# EAGLE design fc64x8 (EAGLE 6.3)
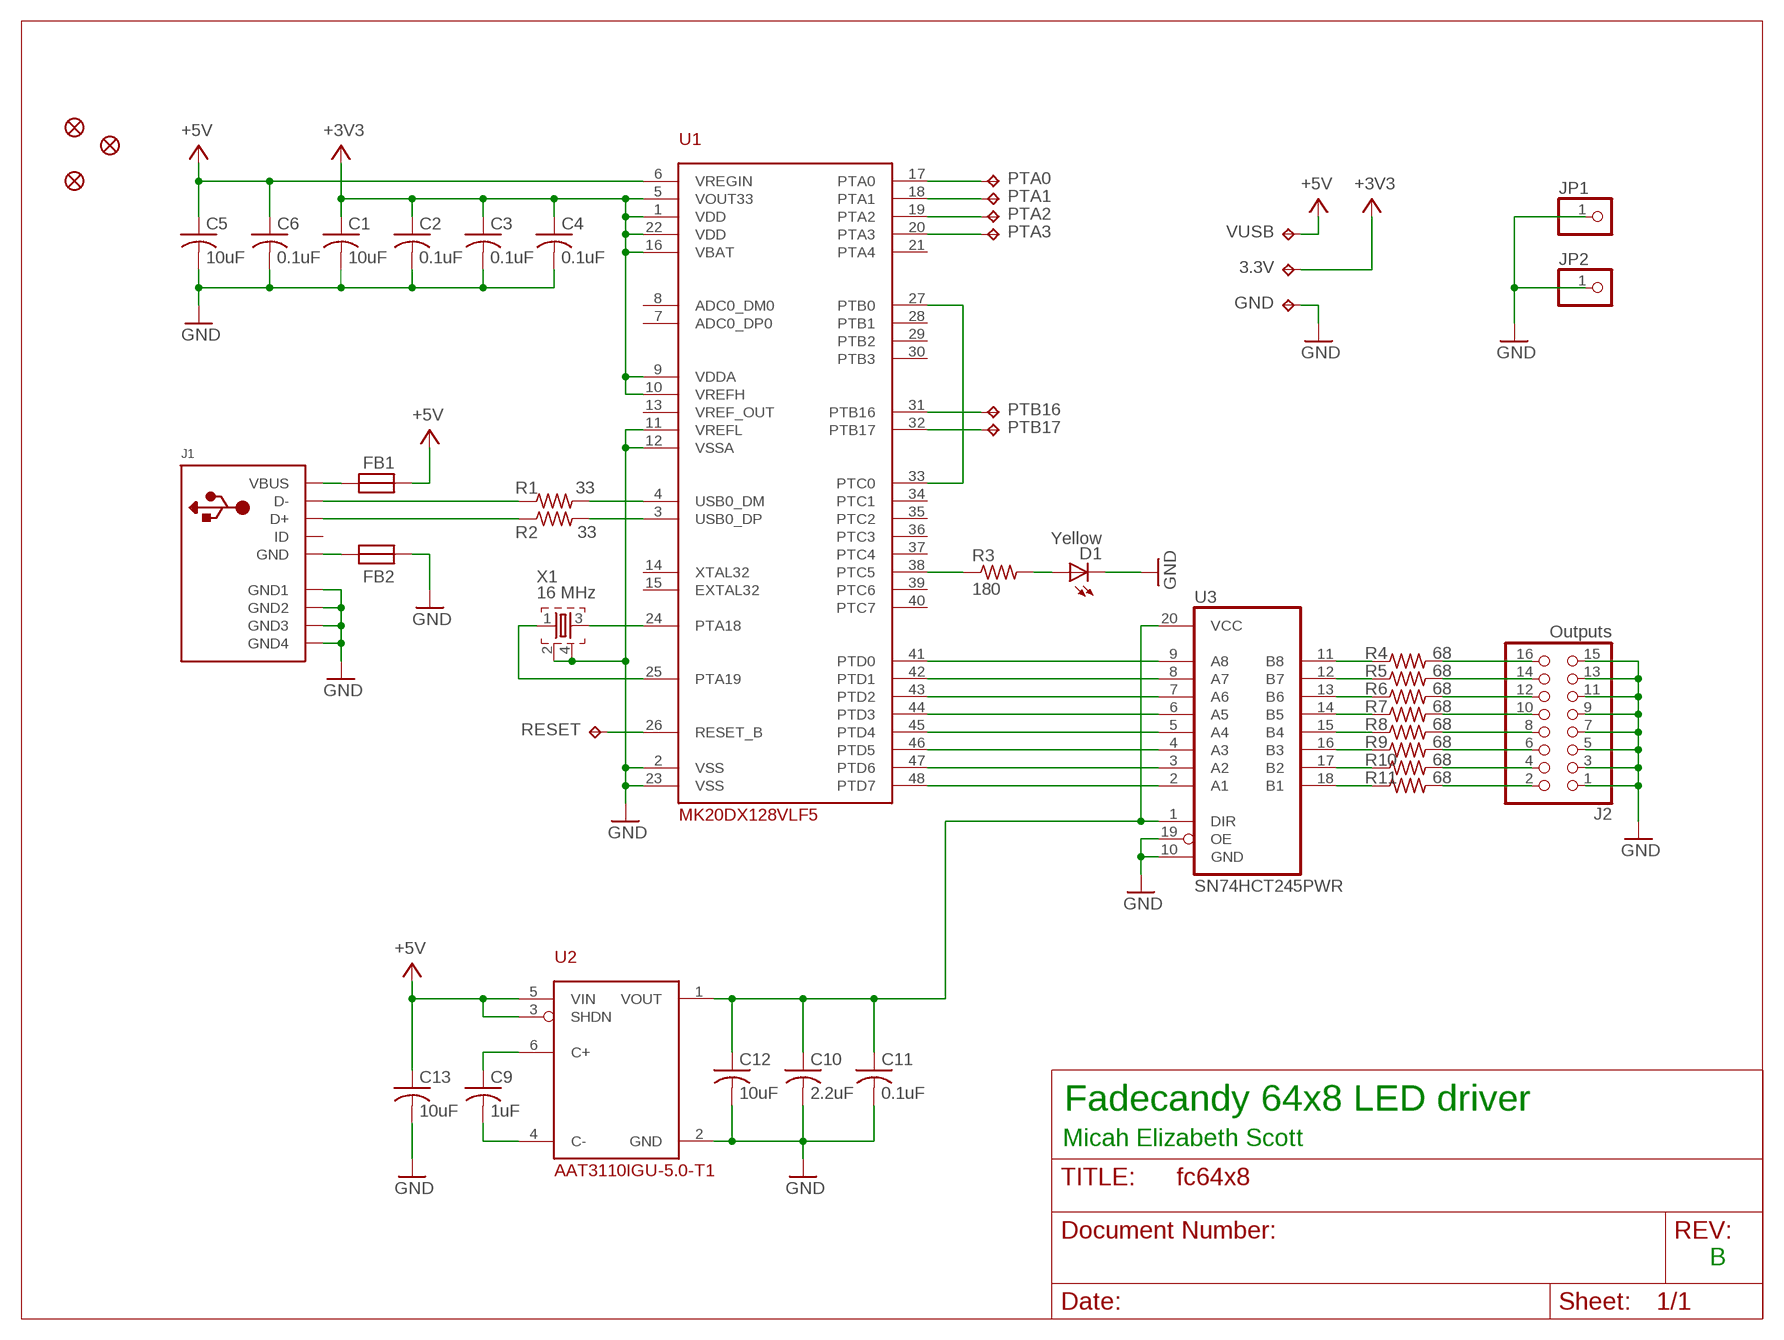
[diagram p0: schematic, sheet 1]

## Parts
3.3V  TPTP18SQ  [TP18SQ]
C1  10uF  C-US0805/NO-OUTLINE  [0805]
C2  0.1uF  C-US0805/NO-OUTLINE  [0805]
C3  0.1uF  C-US0805/NO-OUTLINE  [0805]
C4  0.1uF  C-US0805/NO-OUTLINE  [0805]
C5  10uF  C-US0805/NO-OUTLINE  [0805]
C6  0.1uF  C-US0805/NO-OUTLINE  [0805]
C9  1uF  C-US0805/NO-OUTLINE  [0805]
C10  2.2uF  C-US0805/NO-OUTLINE  [0805]
C11  0.1uF  C-US0805/NO-OUTLINE  [0805]
C12  10uF  C-US0805/NO-OUTLINE  [0805]
C13  10uF  C-US0805/NO-OUTLINE  [0805]
D1  Yellow  LEDCHIP-LED0805  [CHIP-LED0805]
FB1  FB0805/NO-OUTLINE  [0805]
FB2  FB0805/NO-OUTLINE  [0805]
FID1  FIDUCIAL""  [FIDUCIAL_1MM]
FID2  FIDUCIAL""  [FIDUCIAL_1MM]
FID3  FIDUCIAL""  [FIDUCIAL_1MM]
GND  TPTP18SQ  [TP18SQ]
J1  USBMINIB  [USB-MINIB]
J2  Outputs  PINHD-2X8  [2X08]
JP1  PINHD-1X1  [1X01]
JP2  PINHD-1X1  [1X01]
PTA0  TPTP18SQ  [TP18SQ]
PTA1  TPTP18SQ  [TP18SQ]
PTA2  TPTP18SQ  [TP18SQ]
PTA3  TPTP18SQ  [TP18SQ]
PTB16  TPTP18SQ  [TP18SQ]
PTB17  TPTP18SQ  [TP18SQ]
R1  33  R-US_0805/NO-OUTLINE  [0805]
R2  33  R-US_0805/NO-OUTLINE  [0805]
R3  180  R-US_0805/NO-OUTLINE  [0805]
R4  68  R-US_0805/NO-OUTLINE  [0805]
R5  68  R-US_0805/NO-OUTLINE  [0805]
R6  68  R-US_0805/NO-OUTLINE  [0805]
R7  68  R-US_0805/NO-OUTLINE  [0805]
R8  68  R-US_0805/NO-OUTLINE  [0805]
R9  68  R-US_0805/NO-OUTLINE  [0805]
R10  68  R-US_0805/NO-OUTLINE  [0805]
R11  68  R-US_0805/NO-OUTLINE  [0805]
RESET  TPTP18SQ  [TP18SQ]
U1  MK20DX128VLF5  [LQFP48]
U2  AAT3110IGU-5.0-T1  AAT3110  [SOT23-6L]
U3  SN74HCT245PWR  74245PW  [TSSOP20]
VUSB  TPTP18SQ  [TP18SQ]
X1  16 MHz  TSX-32250  [TSX-3225]

## Nets
+3V3: 3.3V.TP C1.1 C2.1 C3.1 C4.1 U1.1(VDD) U1.5(VOUT33) U1.9(VDDA) U1.10(VREFH) U1.16(VBAT) U1.22(VDD)
+5V: C5.1 C6.1 C13.1 FB1.2 U1.6(VREGIN) U2.3(SHDN) U2.5(VIN) VUSB.TP
GND: C1.2 C2.2 C3.2 C4.2 C5.2 C6.2 C10.2 C11.2 C12.2 C13.2 D1.C FB2.2 GND.TP J1.GND1 J1.GND2 J1.GND3 J1.GND4 J2.1 J2.3 J2.5 J2.7 J2.9 J2.11 J2.13 J2.15 JP1.1 JP2.1 U1.2(VSS) U1.11(VREFL) U1.12(VSSA) U1.23(VSS) U2.2(GND) U3.10(GND) U3.19(OE) X1.2 X1.4
N$1: R3.1 U1.38(PTC5)
N$2: U1.24(PTA18) X1.3
N$3: D1.A R3.2
N$4: U1.25(PTA19) X1.1
N$5: FB1.1 J1.VBUS
N$6: U1.27(PTB0) U1.33(PTC0)
N$7: FB2.1 J1.GND
N$8: U1.41(PTD0) U3.9(A8)
N$9: J1.D- R1.1
N$10: J1.D+ R2.1
N$11: R1.2 U1.4(USB0_DM)
N$12: R2.2 U1.3(USB0_DP)
N$13: U1.42(PTD1) U3.8(A7)
N$14: U1.43(PTD2) U3.7(A6)
N$15: U1.44(PTD3) U3.6(A5)
N$16: U1.45(PTD4) U3.5(A4)
N$17: U1.46(PTD5) U3.4(A3)
N$18: U1.47(PTD6) U3.3(A2)
N$19: U1.48(PTD7) U3.2(A1)
N$20: R4.1 U3.11(B8)
N$21: C9.1 U2.6(C+)
N$22: C9.2 U2.4(C-)
N$23: R5.1 U3.12(B7)
N$24: R6.1 U3.13(B6)
N$25: R7.1 U3.14(B5)
N$26: R8.1 U3.15(B4)
N$27: C10.1 C11.1 C12.1 U2.1(VOUT) U3.1(DIR) U3.20(VCC)
N$28: R9.1 U3.16(B3)
N$29: R10.1 U3.17(B2)
N$30: R11.1 U3.18(B1)
N$31: J2.16 R4.2
N$32: J2.14 R5.2
N$33: J2.12 R6.2
N$34: J2.10 R7.2
N$35: J2.8 R8.2
N$36: J2.6 R9.2
N$37: J2.4 R10.2
N$38: J2.2 R11.2
N$39: RESET.TP U1.26(RESET_B)
N$40: PTA0.TP U1.17(PTA0)
N$41: PTA1.TP U1.18(PTA1)
N$42: PTA2.TP U1.19(PTA2)
N$43: PTA3.TP U1.20(PTA3)
N$45: PTB16.TP U1.31(PTB16)
N$46: PTB17.TP U1.32(PTB17)
Unconnected: J1.ID U1.7(ADC0_DP0) U1.8(ADC0_DM0) U1.13(VREF_OUT) U1.14(XTAL32) U1.15(EXTAL32) U1.21(PTA4) U1.28(PTB1) U1.29(PTB2) U1.30(PTB3) U1.34(PTC1) U1.35(PTC2) U1.36(PTC3) U1.37(PTC4) U1.39(PTC6) U1.40(PTC7)

## Notes on the sheet
- Fadecandy 64x8 LED driver
- Micah Elizabeth Scott
- B

## Library data of the parts
3.3V GND PTA0 PTA1-PTA3 PTB16 PTB17 RESET VUSB = testpad:TP: Test pad
C1-C6 C9-C13 = scanlime:C-US: CAPACITOR, American symbol
D1 = adafruit:LED: LED OSRAM: - CHIPLED LG R971, LG N971, LY N971, LG Q971, LY Q971, LO R971, LY R971 LH N974, LH R974 LS Q976, LO Q976, LY Q976 LO Q996 - Hyper CHIPLED LW Q18S LB Q993, LB Q99A, LB R99A - SideLED LS A670, LO A670, LY A670, LG A670, LP A670 LB A673, LV A673, LT A673, LW A673 LH A674 LY A675 LS A676, LA A676, LO A676, LY A676, LW A676 LS A679, LY A679, LG A679 - Hyper Micro SIDELED® LS Y876, LA Y876, LO Y876, LY Y876 LT Y87S - SmartLED LW L88C, LW L88S LB L89C, LB L89S, LG L890 LS L89K, LO L89K, LY L89K LS L896, LA L896, LO L896, LY L896 - TOPLED LS T670, LO T670, LY T670, LG T670, LP T670 LSG T670, LSP T670, LSY T670, LOP T670, LYG T670 LG T671, LOG T671, LSG T671 LB T673, LV T673, LT T673, LW T673 LH T674 LS T676, LA T676, LO T676, LY T676, LB T676, LH T676, LSB T676, LW T676 LB T67C, LV T67C, LT T67C, LS T67K, LO T67K, LY T67K, LW E67C LS E67B, LA E67B, LO E67B, LY E67B, LB E67C, LV E67C, LT E67C LW T67C LS T679, LY T679, LG T679 LS T770, LO T770, LY T770, LG T770, LP T770 LB T773, LV T773, LT T773, LW T773 LH T774 LS E675, LA E675, LY E675, LS T675 LS T776, LA T776, LO T776, LY T776, LB T776 LHGB T686 LT T68C, LB T68C - Hyper Mini TOPLED® LB M676 - Mini TOPLED Santana® LG M470 LS M47K, LO M47K, LY M47K Source: http://www.osram.convergy.de/
FB1 FB2 = scanlime:FB
FID1-FID3 = microbuilder:FIDUCIAL: Fiducial Alignment Points Various fiducial points for machine vision alignment.; BOM: EXCLUDE
J1 = scanlime:USB: USB Connectors USBMINIB - Surface Mount Female Mini-B USB Connector 4UConnector: 06564 By microbuilder.eu Thru-hole RA Female Mini-B USB Connector 4UConnector: 18732 By ladyada.net
J2 = pinhead:PINHD-2X8: PIN HEADER
JP1 JP2 = pinhead:PINHD-1X1: PIN HEADER
R1-R11 = scanlime:R-US_: RESISTOR, American symbol
U1 = scanlime:MK20DX128VLF5: ARM Cortex-M4 microcontroller with USB. Freescale K20 series 50 MHz 16 K RAM 128 K Flash Lower pincount equivalent to Teensy 3.0 2013 Price: $2.66 qty 100 Digi-Key: MK20DX128VLF50-ND <http://www.digikey.com/product-detail/en/MK20DX128VLF5/MK20DX128VLF50-ND/3507511>
U2 = scanlime:AAT3110: Switched capacitor boost converter
U3 = scanlime:74*245: Octal BUS TRANSCEIVER, 3-state
X1 = scanlime:TSX-3225: MHz RANGE CRYSTAL UNIT Source: Epson Toyocom

## Board
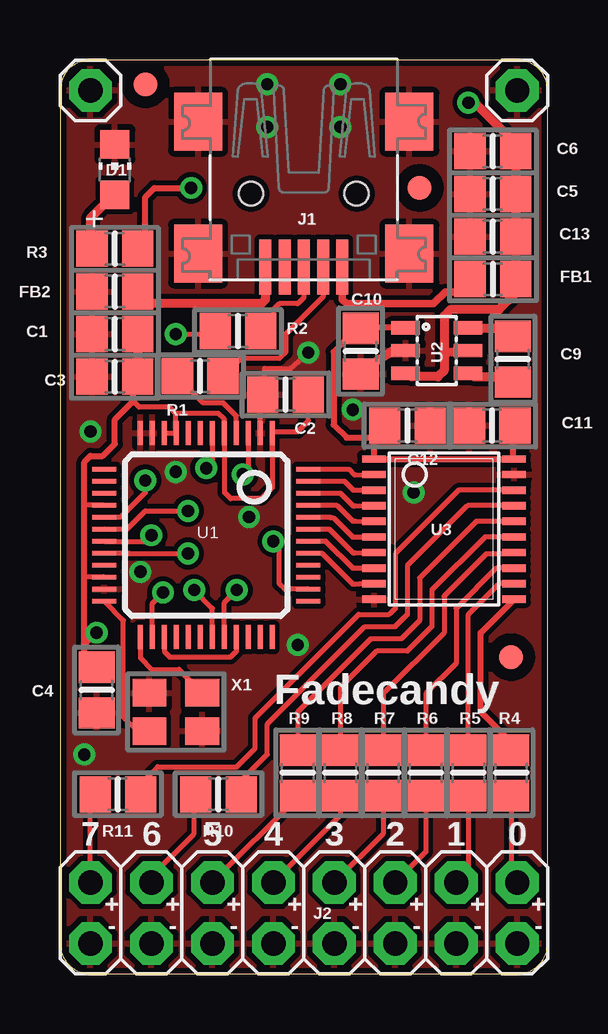
[diagram p1: board, top side]
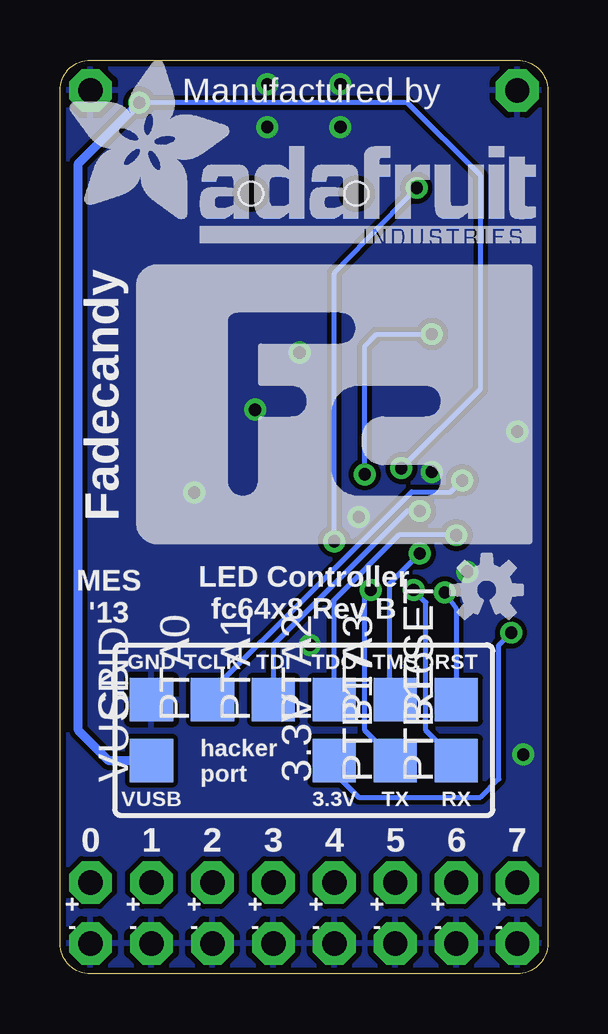
[diagram p2: board, bottom side, seen from below]

Size 20.32 x 38.1 mm. Coordinates in mm from the lower left corner, seen from the top.
Outline: 0,36.83 0,1.27 arc90 1.27,0 19.05,0 arc90 20.32,1.27 20.32,36.83 arc90 19.05,38.1 1.27,38.1 arc90 0,36.83
Copper layers (1*16): Top 0.035mm / dielectric 1.5mm / Bottom 0.035mm
Design rules "adafruit *": minimum track width 8mil, minimum drill 15.5mil, track to track 8mil, track to pad 8mil, pad to pad 8mil, via to via 8mil, smd to smd 8mil, copper to edge 10mil, drill to drill 8mil, minimum pad ring 15mil, minimum via ring 8mil, stop-mask expansion 4mil, vias tented up to drill 20mil, thermal gap 10mil

### Footprints (pad centres in the part's own frame; a part is rotated, then mirrored left to right if it is on the bottom)
TP18SQ = smd 1.8 x 1.8: TP 0,0
0805 = smd 1.3 x 1.5: 1 -0.95,0; 2 0.95,0
CHIP-LED0805 = smd 1.2 x 1.2: A 0,-1.05; C 0,1.05
FIDUCIAL_1MM = smd 1 x 1: 1 0,0
USB-MINIB = smd 0.5 x 2.308: D+ 0,4.064; D- -0.8,4.064; GND 1.6,4.064; ID 0.8,4.064; VBUS -1.6,4.064 | smd 2 x 2.4: GND1 -4.4,-2; GND2 -4.4,3.5; GND3 4.4,3.5; GND4 4.4,-2 | hole 1: -2.2,1; 2.2,1
2X08 = drill 1.016 octagon: 1 -8.89,-1.27; 2 -8.89,1.27; 3 -6.35,-1.27; 4 -6.35,1.27; 5 -3.81,-1.27; 6 -3.81,1.27; 7 -1.27,-1.27; 8 -1.27,1.27; 9 1.27,-1.27; 10 1.27,1.27; 11 3.81,-1.27; 12 3.81,1.27; 13 6.35,-1.27; 14 6.35,1.27; 15 8.89,-1.27; 16 8.89,1.27
1X01 = drill 1.016 octagon: 1 0,0
LQFP48 = smd 0.203 x 1: 1 -2.75,-4.25; 2 -2.25,-4.25; 3 -1.75,-4.25; 4 -1.25,-4.25; 5 -0.75,-4.25; 6 -0.25,-4.25; 7 0.25,-4.25; 8 0.75,-4.25; 9 1.25,-4.25; 10 1.75,-4.25; 11 2.25,-4.25; 12 2.75,-4.25; 25 2.75,4.25; 26 2.25,4.25; 27 1.75,4.25; 28 1.25,4.25; 29 0.75,4.25; 30 0.25,4.25; 31 -0.25,4.25; 32 -0.75,4.25; 33 -1.25,4.25; 34 -1.75,4.25; 35 -2.25,4.25; 36 -2.75,4.25 | smd 1 x 0.203: 13 4.25,-2.75; 14 4.25,-2.25; 15 4.25,-1.75; 16 4.25,-1.25; 17 4.25,-0.75; 18 4.25,-0.25; 19 4.25,0.25; 20 4.25,0.75; 21 4.25,1.25; 22 4.25,1.75; 23 4.25,2.25; 24 4.25,2.75; 37 -4.25,2.75; 38 -4.25,2.25; 39 -4.25,1.75; 40 -4.25,1.25; 41 -4.25,0.75; 42 -4.25,0.25; 43 -4.25,-0.25; 44 -4.25,-0.75; 45 -4.25,-1.25; 46 -4.25,-1.75; 47 -4.25,-2.25; 48 -4.25,-2.75
SOT23-6L = smd 0.55 x 1.2: 1 -0.95,-1.3; 2 0,-1.3; 3 0.95,-1.3; 4 0.95,1.3; 5 0,1.3; 6 -0.95,1.3
TSSOP20 = smd 0.305 x 0.991: 1 -2.925,-2.918; 2 -2.275,-2.918; 3 -1.625,-2.918; 4 -0.975,-2.918; 5 -0.325,-2.918; 6 0.325,-2.918; 7 0.975,-2.918; 8 1.625,-2.918; 9 2.275,-2.918; 10 2.925,-2.918; 11 2.925,2.918; 12 2.275,2.918; 13 1.625,2.918; 14 0.975,2.918; 15 0.325,2.918; 16 -0.325,2.918; 17 -0.975,2.918; 18 -1.625,2.918; 19 -2.275,2.918; 20 -2.925,2.918
TSX-3225 = smd 1.4 x 1.15: 1 -1.1,-0.8; 2 1.1,-0.8; 3 1.1,0.8; 4 -1.1,0.8

### Placement (x,y rotation side)
3.3V  8.89,8.89 90 bottom
C1  2.29,26.67 180 top
C2  9.4,24.16 180 top
C3  2.29,24.89 180 top
C4  1.52,11.84 270 top
C5  18.03,32.51 180 top
C6  18.03,34.29 180 top
C9  18.87,25.63 270 top
C10  12.52,25.96 270 top
C11  18.01,22.86 180 top
C12  14.48,22.86 0 top
C13  18.03,30.73 180 top
D1  2.29,33.53 0 top
FB1  18.03,28.96 0 top
FB2  2.29,28.45 180 top
FID1  18.8,13.21 0 top
FID2  14.99,32.77 0 top
FID3  3.56,37.08 0 top
GND  16.51,11.43 90 bottom
J1  10.16,33.53 180 top
J2  10.16,2.54 0 top
JP1  1.27,36.83 0 top
JP2  19.05,36.83 0 top
PTA0  13.97,11.43 90 bottom
PTA1  11.43,11.43 90 bottom
PTA2  8.89,11.43 90 bottom
PTA3  6.35,11.43 90 bottom
PTB16  3.81,8.89 90 bottom
PTB17  6.35,8.89 90 bottom
R1  5.84,24.92 180 top
R2  7.42,26.8 180 top
R3  2.29,30.23 180 top
R4  18.8,8.38 270 top
R5  17.02,8.38 270 top
R6  15.24,8.38 270 top
R7  13.46,8.38 270 top
R8  11.68,8.38 270 top
R9  9.91,8.38 270 top
R10  6.6,7.49 180 top
R11  2.41,7.49 180 top
RESET  3.81,11.43 90 bottom
U1  6.1,18.29 180 top
U2  15.7,25.98 270 top
U3  16,18.54 270 top
U$1  [OSHW-LOGO-S]  2.54,16 0 bottom
U$2  [ADAFRUIT_TEXT_20MM]  20.07,30.48 0 bottom
VUSB  16.51,8.89 90 bottom
X1  4.83,10.92 180 top

### Tracks (layer width: path | path; a pad name or v marks a point on that pad's centre or on a via)
+3V3  (via drill 0.51)
  Top 0.203: 1.02,16.51 1.04,16.54 U1.22 | 1.04,19.54 1.02,19.56 U1.16 | 1.02,13.46 1.02,13.72 v1.52,14.22 | U1.10 U1.9 | 1.02,12.95 C4.1 | U1.1 8.91,22.61 9.91,22.61 10.35,23.05 C2.1 | U1.9 4.83,22.56 4.83,23.37 | U1.1 8.89,22.58 | U1.9 4.83,22.52 | 8.85,21.8 U1.1 | 4.83,23.37 4.57,23.62 3.3,23.62 3.05,23.88 | U1.1 8.85,20.28 8.38,19.81 7.11,19.81 6.86,20.07 6.86,22.53 U1.5 6.85,23.13 6.6,23.37 4.83,23.37
  Top 0.254: 1.02,12.95 1.02,13.46 1.02,16.51 1.02,19.56 1.02,21.34 1.27,21.59 1.78,21.59 2.29,22.1 2.29,23.11 3.05,23.88 3.05,24.7 C3.1
  Top 0.381: C1.1 C3.1
  Bottom 0.203: 3.3V.TP 8.89,8.38 7.87,7.37 2.79,7.37 2.03,8.13 2.03,13.72 v1.52,14.22
+5V  (via drill 0.51)
  Top 0.203: 18.8,34.8 18.8,34.48 C6.1 | U1.6 6.35,21.33 v6.1,21.08
  Top 0.381: C6.1 C5.1 C13.1 FB1.2 18.98,28.38 18.29,27.69 16.26,27.69 16,27.43 16,25.91 | 16,25.91 16,25.15 15.75,24.89 14.67,24.89 U2.3 | U2.5 16.03,25.88 16,25.91 | v17.02,36.32 17.27,36.32 18.8,34.8
  Bottom 0.203: v6.1,21.08 2.79,24.38 2.79,33.27 5.84,36.32 v17.02,36.32
  Bottom 0.381: VUSB.TP 18.29,8.89 19.56,10.16 19.56,33.78 v17.02,36.32
GND  (via drill 0.51)
  Top 0.203: U1.2 8.35,24.03 C2.2 8.52,25.03 8.53,25.22 | 9.58,25.22 v10.34,25.91
  Top 0.254: 8.53,25.22 9.58,25.22
  Top 0.381: U2.2 13.89,25.98 13.01,25.43 12.86,25.3 C10.2
  other vias: 1.02,9.14 14.73,20.07 7.87,19.05 1.27,22.61 3.35,16.76 4.83,20.93 12.19,23.52 8.64,35.31 11.68,35.31 9.91,13.72 8.64,37.08 11.68,37.08
  pour Bottom: 0,38.1 20.32,38.1 20.32,0 0,0
  pour Top: 0,38.1 20.32,38.1 20.32,0 0,0
N$1  (via drill 0.51)
  Top 0.203: 3.56,30.55 R3.1 | U1.38 9.36,16.04 9.14,16.26 9.14,17.78 v8.89,18.03
  Top 0.254: 3.56,30.55 3.56,32.38 3.94,32.77 v5.46,32.77
  Bottom 0.203: v8.89,18.03 8.89,29.21 v5.46,32.77
N$2
  Top 0.203: X1.3 3.21,10.12 2.64,10.69 2.64,14.74 U1.24
N$3
  Top 0.381: D1.A 2.25,32.48 1.27,31.5 1.27,30.29 R3.2
N$4
  Top 0.203: U1.25 3.35,13.16 3.81,12.7 4.95,12.7 X1.1
N$5
  Top 0.305: J1.VBUS 11.76,28.12 11.94,27.94 15.56,27.94 16.05,28.42 16.94,28.42
  Top 0.381: 16.94,28.42 FB1.1
N$6
  Top 0.203: U1.27 4.35,13.43 4.57,13.21 7.11,13.21 7.35,13.44 U1.33
N$7
  Top 0.381: J1.GND 8.56,28.12 8.38,27.94 3.49,27.94 FB2.1
N$8
  Top 0.203: 12.45,16.26 U3.9 12.31,16.26 12.19,16.26 10.91,17.54 U1.41
N$9
  Top 0.203: J1.D- 10.96,28.23 9.4,26.67 9.4,25.91 9.14,25.65 7.53,25.65 R1.1
N$10
  Top 0.203: J1.D+ 10.16,28.19 9.91,27.94 9.14,27.94 8.89,27.69 8.89,27.32 R2.1
N$11
  Top 0.203: U1.4 7.35,23.26 6.81,23.8 5.96,23.8 R1.2
N$12  (via drill 0.51)
  Top 0.203: U1.3 7.85,21.05 v7.62,20.83 | v4.83,26.67 6.39,26.67 R2.2
  Bottom 0.203: v7.62,20.83 7.62,26.16 7.11,26.67 v4.83,26.67
N$13
  Top 0.203: 10.66,18.04 U1.42 11.07,18.03 12.19,16.92 12.32,16.92 U3.8
N$14
  Top 0.203: U1.43 10.66,18.54 10.92,18.54 11.23,18.54 12.22,17.55 12.31,17.55 U3.7
N$15
  Top 0.203: U1.44 11.26,19.04 11.28,19.02 11.38,19.02 12.19,18.21 12.32,18.21 U3.6
N$16
  Top 0.203: U1.45 11.53,19.54 12.19,18.87 12.32,18.87 U3.5
N$17
  Top 0.203: U1.46 11.69,20.04 12.22,19.51 12.31,19.51 U3.4
N$18
  Top 0.203: U1.47 11.85,20.54 12.22,20.17 12.32,20.17 U3.3
N$19
  Top 0.203: U1.48 12.03,21.04 12.27,20.8 12.31,20.8 U3.2
N$20
  Top 0.203: 18.8,15.49 U3.11
  Top 0.254: R4.1 18.8,9.65 17.53,10.92 17.53,14.22 U3.11
N$21
  Top 0.381: 18.75,26.5 C9.1 18.63,26.58 18.29,26.92 17.32,26.92 U2.6
N$22
  Top 0.381: 18.75,24.6 C9.2 18.5,24.68 18.29,24.89 17.27,24.89 U2.4
N$23
  Top 0.203: U3.12 18.3,16.27 17.02,14.99 R5.1
N$24
  Top 0.203: U3.13 18.19,16.92 16.51,15.24 16.51,12.95 15.24,11.68 R6.1
N$25
  Top 0.203: U3.14 18.88,17.53 17.78,17.53 16,15.75 16,14.22 13.46,11.68 R7.1
N$26
  Top 0.203: U3.15 17.71,18.22 15.49,16 15.49,14.48 14.48,13.46 13.21,13.46 11.68,11.94 R8.1
N$27
  Top 0.254: U2.1 12.84,26.93 12.95,26.42 12.74,26.42 | 12.74,26.42 C10.1 | 12.74,26.42 11.84,26.36 11.4,25.93 11.4,22.89 11.94,22.35 13.02,22.35 | 13.02,22.35 C12.1 | 13.02,22.35 13.08,22.29 U3.1 U3.20 18.88,21.5 18.88,22.79 C11.1
N$28
  Top 0.203: U3.16 17.34,18.87 14.99,16.51 14.99,14.73 14.22,13.97 12.95,13.97 9.91,10.92 R9.1
N$29
  Top 0.203: U3.17 16.98,19.52 14.48,17.02 14.48,14.99 13.97,14.48 12.7,14.48 8.64,10.41 8.64,9.14 7.55,8.06 R10.1
N$30
  Top 0.203: U3.18 16.61,20.17 13.97,17.53 13.97,15.24 13.72,14.99 12.45,14.99 8.13,10.67 8.13,9.4 7.37,8.64 4.06,8.64 3.36,7.93 R11.1
N$31
  Top 0.203: R4.2 18.8,4.06 J2.16
N$32
  Top 0.203: R5.2 17.02,4.32 J2.14
N$33
  Top 0.203: R6.2 15.24,5.08 J2.12
N$34
  Top 0.203: R7.2 13.46,5.84 J2.10
N$35
  Top 0.203: R8.2 11.68,6.6 J2.8
N$36
  Top 0.203: R9.2 9.91,7.37 J2.6
N$37
  Top 0.203: J2.4 3.81,4.06 5.59,5.84 5.59,7.43 R10.2
N$38
  Top 0.203: J2.2 1.27,7.3 R11.2
N$39  (via drill 0.51)
  Top 0.203: U1.26 3.85,15.45 v4.29,15.9
  Bottom 0.203: v4.29,15.9 3.81,15.24 RESET.TP
N$40  (via drill 0.51)
  Top 0.203: U1.17 2.53,19.04 3.56,20.07 v3.56,20.57
  Bottom 0.203: PTA0.TP 13.97,11.81 5.66,20.09 4.04,20.09 v3.56,20.57
N$41  (via drill 0.51)
  Top 0.203: U1.18 arc45 U1.18 2.79,18.54 3.56,19.3 v5.33,19.3
  Bottom 0.203: 11.18,12.19 11.43,12.19 PTA1.TP 11.43,13.72 5.84,19.3 v5.33,19.3
N$42  (via drill 0.51)
  Top 0.203: U1.19 arc45 U1.19 3.56,18.03 v3.81,18.29
  Bottom 0.203: v3.81,18.29 6.2,18.29 8.91,15.57 8.91,11.46 PTA2.TP
N$43  (via drill 0.51)
  Top 0.203: v5.33,17.53 2.64,17.53 2.88,17.54 U1.20
  Bottom 0.203: v5.33,17.53 6.6,16.26 6.6,11.68 PTA3.TP
N$45  (via drill 0.51)
  Top 0.203: U1.31 6.35,15.24 v5.59,16
  Bottom 0.203: PTB16.TP 5.08,10.16 5.08,15.49 v5.59,16
N$46  (via drill 0.51)
  Top 0.203: U1.32 6.85,15.48 v7.37,16
  Bottom 0.203: PTB17.TP 7.62,10.16 7.62,15.75 v7.37,16

### Text on the board
tPlace: Fadecandy | 7 | 6 | 5 | 4 | 3 | 2 | 1 | 0 | + | + | + | + | + | + | + | + | - | - | - | - | - | - | - | -
bPlace: Manufactured by | Fadecandy | LED Controller / fc64x8 Rev B | MES / '13 | RST | TMS | TDO | TDI | TCLK | GND | hacker / port | RX | TX | 3.3V | VUSB | 7 | 6 | 5 | 4 | 3 | 2 | 1 | 0 | + | + | + | + | + | + | + | + | - | - | - | - | - | - | - | -